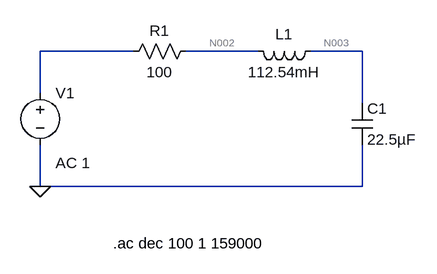
[diagram p0: schematic RetoHPF.asc]
RetoHPF.asc, the LTspice schematic file:
Version 4.1
SHEET 1 1256 680
WIRE 32 64 -112 64
WIRE 224 64 112 64
WIRE 384 64 304 64
WIRE -112 128 -112 64
WIRE 384 144 384 64
WIRE -112 272 -112 208
WIRE 384 272 384 208
WIRE 384 272 -112 272
FLAG -112 272 0
SYMBOL voltage -112 112 R0
WINDOW 123 24 124 Left 2
WINDOW 39 0 0 Left 0
SYMATTR InstName V1
SYMATTR Value ""
SYMATTR Value2 AC 1
SYMBOL res 128 48 R90
WINDOW 0 0 56 VBottom 2
WINDOW 3 32 56 VTop 2
SYMATTR InstName R1
SYMATTR Value 100
SYMBOL ind 320 48 R90
WINDOW 0 5 56 VBottom 2
WINDOW 3 32 56 VTop 2
SYMATTR InstName L1
SYMATTR Value 112.54mH
SYMBOL cap 368 144 R0
SYMATTR InstName C1
SYMATTR Value 22.5µF
TEXT 0 360 Left 2 !.ac dec 100 1 159000

The netlist it stands for:
* RetoHPF.asc
V1 N001 0 AC 1
R1 N002 N001 100
L1 N003 N002 112.54mH
C1 N003 0 22.5µF
.ac dec 100 1 159000
.backanno
.end

* Results of the author's LTspice run, read from the files saved beside the schematic
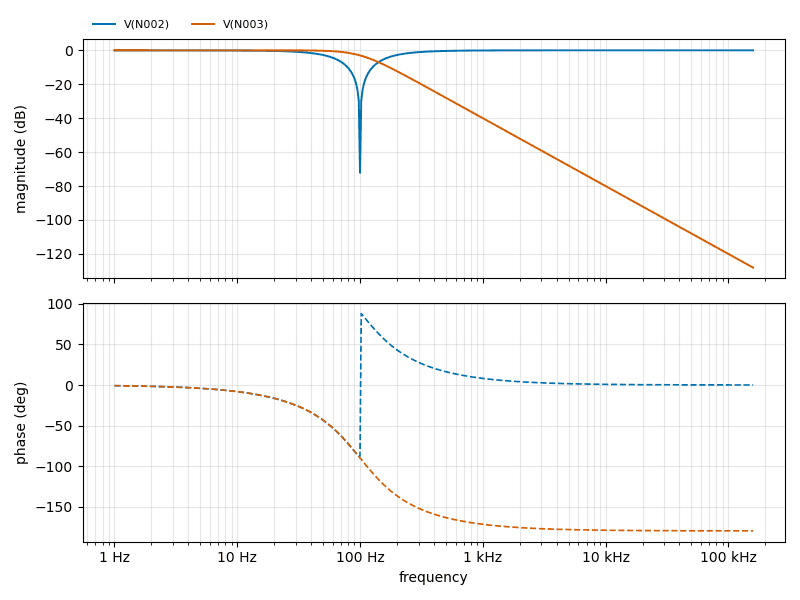
[diagram p1: AC Analysis of RetoHPF.asc, plotted from the saved traces]
* AC Analysis, 1 run:
*   V(N002): -0.00 dB at 1 Hz, -0.00 dB at 159 kHz, peak -0.00 dB at 159 kHz, 3 dB below the peak at 193.2 Hz
*   V(N003): 0.00 dB at 1 Hz, -128.05 dB at 159 kHz, peak 0.00 dB at 1.82 Hz, 3 dB below the peak at 100 Hz